# EAGLE design working (EAGLE 9.6.2)
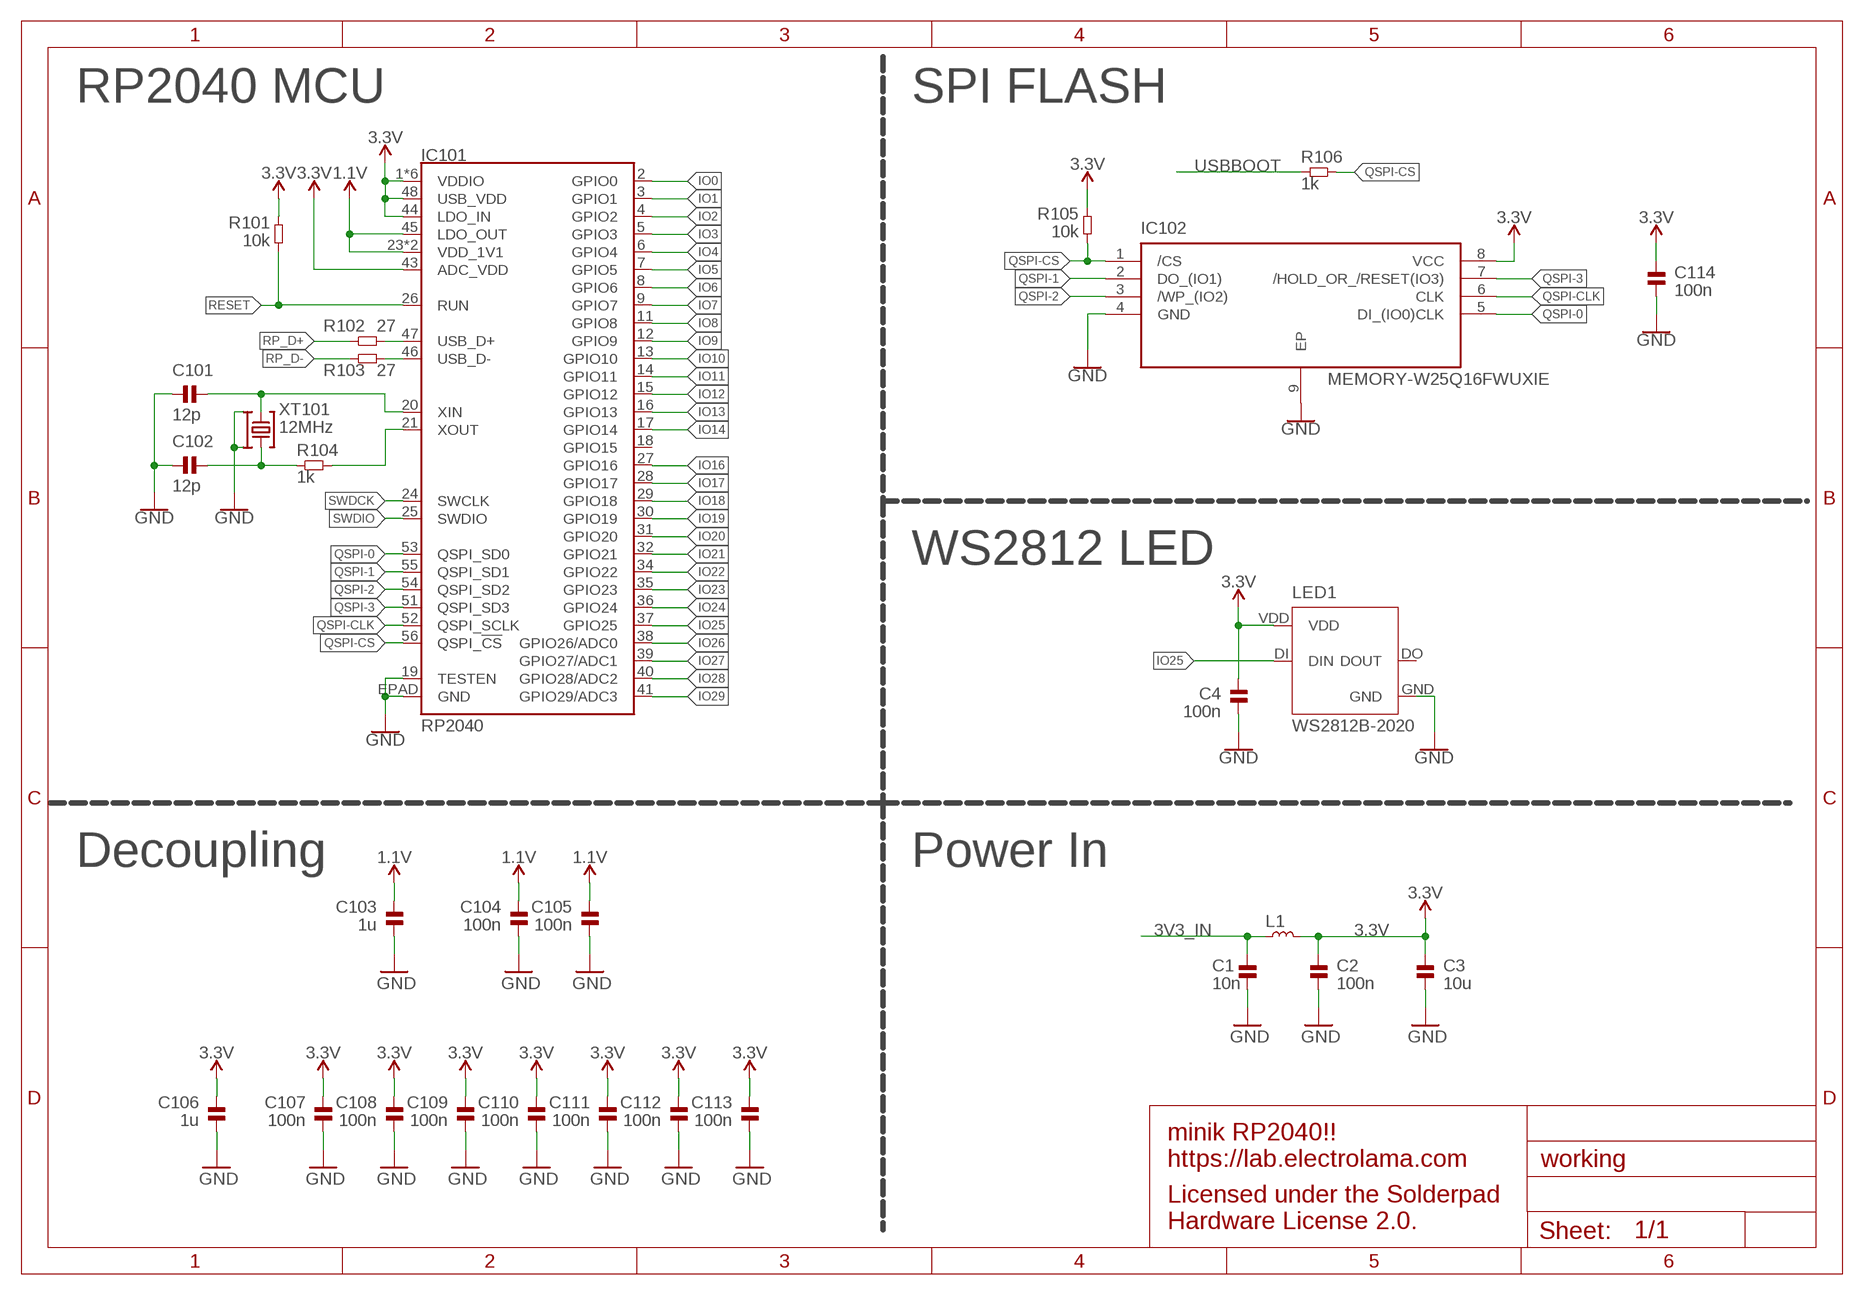
[diagram p0: schematic, sheet 1]

## Parts
C1  10n  CAP-0402  [_PKG_C_0402]
C2  100n  CAP-0402  [_PKG_C_0402]
C3  10u  CAP-0402  [_PKG_C_0402]
C4  100n  CAP-0402  [_PKG_C_0402]
C101  12p  CAP-0402  [_PKG_C_0402]
C102  12p  CAP-0402  [_PKG_C_0402]
C103  1u  CAP-0402  [_PKG_C_0402]
C104  100n  CAP-0402  [_PKG_C_0402]
C105  100n  CAP-0402  [_PKG_C_0402]
C106  1u  CAP-0402  [_PKG_C_0402]
C107  100n  CAP-0402  [_PKG_C_0402]
C108  100n  CAP-0402  [_PKG_C_0402]
C109  100n  CAP-0402  [_PKG_C_0402]
C110  100n  CAP-0402  [_PKG_C_0402]
C111  100n  CAP-0402  [_PKG_C_0402]
C112  100n  CAP-0402  [_PKG_C_0402]
C113  100n  CAP-0402  [_PKG_C_0402]
C114  100n  CAP-0402  [_PKG_C_0402]
IC101  RP2040  [QFN-56]
IC102  MEMORY-W25Q16FWUXIE  [SON50P300X200X60-9N]
L1  INDUCTOR-0402  [_PKG_L_0402]
LED1  WS2812B-2020  [WS2812B-2020]
R101  10k  RES-0402  [_PKG_R_0402]
R102  27  RES-0402  [_PKG_R_0402]
R103  27  RES-0402  [_PKG_R_0402]
R104  1k  RES-0402  [_PKG_R_0402]
R105  10k  RES-0402  [_PKG_R_0402]
R106  1k  RES-0402  [_PKG_R_0402]
XT101  12MHz  XTAL-4P-3225  [XTAL-4P-3225]

## Nets
1.1V: C103.2 C104.2 C105.2 IC101.23(VDD_1V1) IC101.45(LDO_OUT) IC101.50(VDD_1V1)
3.3V: C2.2 C3.2 C4.2 C106.2 C107.2 C108.2 C109.2 C110.2 C111.2 C112.2 C113.2 C114.2 IC101.1(VDDIO) IC101.10(VDDIO) IC101.22(VDDIO) IC101.33(VDDIO) IC101.42(VDDIO) IC101.43(ADC_VDD) IC101.44(LDO_IN) IC101.48(USB_VDD) IC101.49(VDDIO) IC102.8(VCC) L1.2 LED1.VDD R101.2 R105.2
3V3_IN: C1.2 L1.1
GND [Power]: C1.1 C2.1 C3.1 C4.1 C101.1 C102.1 C103.1 C104.1 C105.1 C106.1 C107.1 C108.1 C109.1 C110.1 C111.1 C112.1 C113.1 C114.1 IC101.19(TESTEN) IC101.EPAD(GND) IC102.4(GND) IC102.9(EP) LED1.GND XT101.2 XT101.4
IO0: IC101.2(GPIO0)
IO1: IC101.3(GPIO1)
IO2: IC101.4(GPIO2)
IO3: IC101.5(GPIO3)
IO4: IC101.6(GPIO4)
IO5: IC101.7(GPIO5)
IO6: IC101.8(GPIO6)
IO7: IC101.9(GPIO7)
IO8: IC101.11(GPIO8)
IO9: IC101.12(GPIO9)
IO10: IC101.13(GPIO10)
IO11: IC101.14(GPIO11)
IO12: IC101.15(GPIO12)
IO13: IC101.16(GPIO13)
IO14: IC101.17(GPIO14)
IO16: IC101.27(GPIO16)
IO17: IC101.28(GPIO17)
IO18: IC101.29(GPIO18)
IO19: IC101.30(GPIO19)
IO20: IC101.31(GPIO20)
IO21: IC101.32(GPIO21)
IO22: IC101.34(GPIO22)
IO23: IC101.35(GPIO23)
IO24: IC101.36(GPIO24)
IO25: IC101.37(GPIO25) LED1.DI(DIN)
IO26: IC101.38(GPIO26/ADC0)
IO27: IC101.39(GPIO27/ADC1)
IO28: IC101.40(GPIO28/ADC2)
IO29: IC101.41(GPIO29/ADC3)
N$3: IC101.47(USB_D+) R102.2
N$4: IC101.46(USB_D-) R103.2
QSPI-0: IC101.53(QSPI_SD0) IC102.5(DI_(IO0)CLK)
QSPI-1: IC101.55(QSPI_SD1) IC102.2(DO_(IO1))
QSPI-2: IC101.54(QSPI_SD2) IC102.3(/WP_(IO2))
QSPI-3: IC101.51(QSPI_SD3) IC102.7(/HOLD_OR_/RESET(IO3))
QSPI-CLK: IC101.52(QSPI_SCLK) IC102.6(CLK)
QSPI-CS: IC101.56(QSPI_!CS!) IC102.1(/CS) R105.1 R106.1
RESET: IC101.26(RUN) R101.1
RP_D+: R102.1
RP_D-: R103.1
SWDCK: IC101.24(SWCLK)
SWDIO: IC101.25(SWDIO)
USBBOOT: R106.2
X1A: IC101.21(XOUT) R104.2
X1B: C102.2 R104.1 XT101.1
X2: C101.2 IC101.20(XIN) XT101.3
Unconnected: IC101.18(GPIO15) LED1.DO(DOUT)

## Notes on the sheet
- RP2040 MCU | SPI FLASH
- WS2812 LED
- Decoupling | Power In
- minik RP2040!!
  https://lab.electrolama.com
- Licensed under the Solderpad
  Hardware License 2.0.

## Library data of the parts
C1-C4 C101-C114 = ok-discretes-dev:CAP
IC101 = RP2040:RP2040: Raspberry Pi RP2040 MCU 56-pin 32-bit Microcontroller with 264kB of SRAM and external flash support up to 16MB Getting Started with the RP2040 <https://pico.raspberrypi.org/getting-started/> Dual-core ARM Cortex M0+ processor, flexible clock running up to 133 MHz 264kB of SRAM, and QSPI control of common flash memory USB 1.1 Host and Device support Low-power sleep and dormant modes Drag & drop programming using mass storage over USB 26 multi-function GPIO pins 2×SPI, 2×I2C, 2×UART, 3×12-bit ADC, 16×controllable PWM channels Accurate clock and timer on-chip Temperature sensor Accelerated floating point libraries on-chip 8×Programmable IO (PIO) state machines for custom peripheral support; PROD_ID: IC-15502
IC102 = ok-chips-dev:MEMORY-W25Q16FWUXIE: FLASH - NOR Memory IC 16Mb (2M x 8) SPI 104MHz 8-USON (2x3) Source: Datasheet <https://www.winbond.com/resource-files/w25q16fw reve 10072015 sfdp.pdf>; ARROW_PART_NUMBER: W25Q16FWUXIE TR; ARROW_PRICE-STOCK: https://www.arrow.com/en/products/w25q16fwuxietr/winbond-electronics; DESCRIPTION: FLASH - NOR Memory IC 16Mb (2M x 8) SPI 104MHz 8-USON (2x3); HEIGHT: 0.6mm; MANUFACTURER_NAME: Winbond; MANUFACTURER_PART_NUMBER: W25Q16FWUXIE TR; MOUSER_PART_NUMBER: 454-W25Q16FWUXIETR; MOUSER_PRICE-STOCK: https://www.mouser.co.uk/ProductDetail/Winbond/W25Q16FWUXIE-TR?qs=qSfuJ%252Bfl%2Fd73qYu7obAG3g%3D%3D
L1 = ok-discretes-dev:INDUCTOR
LED1 = ok-opto-dev:WS2812B-2020
R101-R106 = ok-discretes-dev:RES
XT101 = ok-xtal-osc-dev:XTAL-4P-3225

## Net classes
1 Power: width 0.127 mm, clearance 0.178 mm

## Board
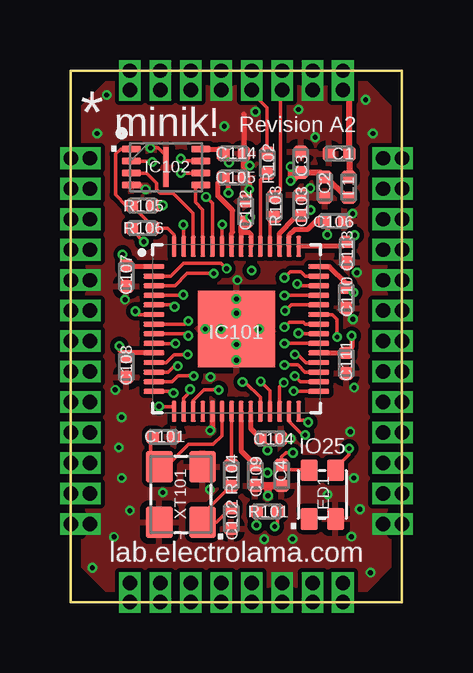
[diagram p1: board, top side]
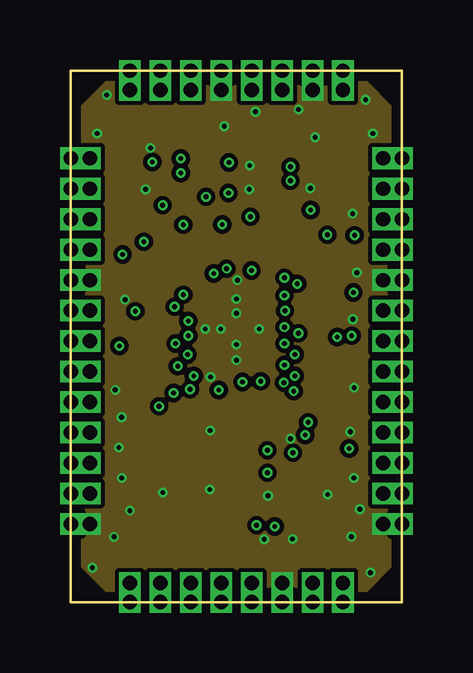
[diagram p2: board, inner layer Route2]
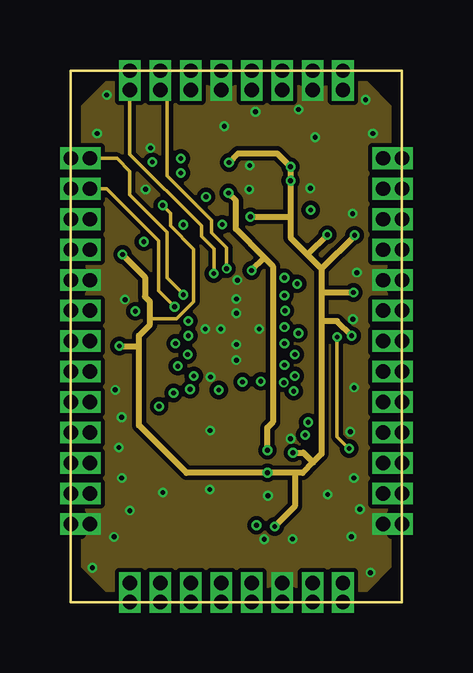
[diagram p3: board, inner layer Route15]
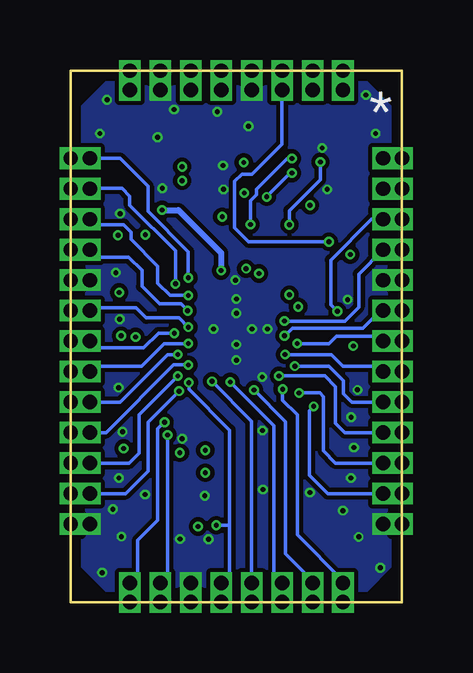
[diagram p4: board, bottom side, seen from below]

Size 13.82 x 22.14 mm. Coordinates in mm from the lower left corner, seen from the top.
Outline: 0,0 0,22.14 13.82,22.14 13.82,0 0,0
Copper layers (1*2*15*16): Top 0.035559375mm / dielectric 0.17018125mm / Route2 0.01778125mm / dielectric 47mil / Route15 0.01778125mm / dielectric 0.17018125mm / Bottom 0.035559375mm
Design rules "oshpark-4layer *": minimum track width 5mil, minimum drill 10mil, track to track 5mil, track to pad 5mil, pad to pad 5mil, via to via 5mil, smd to smd 5mil, copper to edge 15mil, drill to drill 6mil, minimum pad ring 4mil, minimum via ring 4mil, stop-mask expansion 2.5mil, vias tented up to drill 20mil, thermal gap 10mil

### Footprints (pad centres in the part's own frame; a part is rotated, then mirrored left to right if it is on the bottom)
_PKG_C_0402 = smd 0.54 x 0.6: 1 -0.43,0; 2 0.43,0
QFN-56 = smd 0.875 x 0.2: 1 -3.437,2.6; 2 -3.437,2.2; 3 -3.437,1.8; 4 -3.437,1.4; 5 -3.437,1; 6 -3.437,0.6; 7 -3.437,0.2; 8 -3.437,-0.2; 9 -3.437,-0.6; 10 -3.437,-1; 11 -3.437,-1.4; 12 -3.437,-1.8; 13 -3.437,-2.2; 14 -3.437,-2.6; 29 3.437,-2.6; 30 3.437,-2.2; 31 3.437,-1.8; 32 3.437,-1.4; 33 3.437,-1; 34 3.437,-0.6; 35 3.437,-0.2; 36 3.437,0.2; 37 3.437,0.6; 38 3.437,1; 39 3.437,1.4; 40 3.437,1.8; 41 3.437,2.2; 42 3.437,2.6 | smd 0.2 x 0.875: 15 -2.6,-3.437; 16 -2.2,-3.437; 17 -1.8,-3.437; 18 -1.4,-3.437; 19 -1,-3.437; 20 -0.6,-3.437; 21 -0.2,-3.437; 22 0.2,-3.437; 23 0.6,-3.437; 24 1,-3.437; 25 1.4,-3.437; 26 1.8,-3.437; 27 2.2,-3.437; 28 2.6,-3.437; 43 2.6,3.437; 44 2.2,3.437; 45 1.8,3.437; 46 1.4,3.437; 47 1,3.437; 48 0.6,3.437; 49 0.2,3.437; 50 -0.2,3.437; 51 -0.6,3.437; 52 -1,3.437; 53 -1.4,3.437; 54 -1.8,3.437; 55 -2.2,3.437; 56 -2.6,3.437 | smd 3.2 x 3.2: EPAD 0,0
SON50P300X200X60-9N = smd 0.8 x 0.3: 1 -1.45,0.75; 2 -1.45,0.25; 3 -1.45,-0.25; 4 -1.45,-0.75; 5 1.45,-0.75; 6 1.45,-0.25; 7 1.45,0.25; 8 1.45,0.75 | smd 0.25 x 1.65: 9 0,0
_PKG_L_0402 = smd 0.54 x 0.6: 1 -0.43,0; 2 0.43,0
WS2812B-2020 = smd 0.9 x 0.7: DI -1.015,0.55; DO 1.015,-0.55; GND 1.015,0.55; VDD -1.015,-0.55
_PKG_R_0402 = smd 0.54 x 0.6: 1 -0.43,0; 2 0.43,0
XTAL-4P-3225 = smd 1.3 x 1.1: 1 -1.15,-0.9; 2 1.15,-0.9; 3 1.15,0.9; 4 -1.15,0.9

### Placement (x,y rotation side)
C1  11.19,18.68 0 top
C2  10.59,17.28 90 top
C3  9.59,18.33 270 top
C4  8.79,5.28 90 top
C101  3.85,6.88 180 top
C102  6.69,3.48 90 top
C103  9.59,16.53 270 top
C104  8.34,6.82 180 top
C105  6.79,17.68 180 top
C106  10.99,15.88 180 top
C107  2.32,13.58 90 top
C108  2.32,9.8 90 top
C109  7.69,5.28 90 top
C110  11.49,12.68 90 top
C111  11.49,9.96 90 top
C112  7.3,16.28 270 top
C113  11.52,14.58 90 top
C114  6.79,18.68 180 top
IC101  6.91,11.38 0 top
IC102  3.98,18.13 0 top
L1  11.59,17.28 270 top
LED1  10.49,4.48 270 top
R101  8.19,3.78 0 top
R102  8.19,18.28 270 top
R103  8.49,16.48 270 top
R104  6.69,5.28 90 top
R105  2.99,16.52 0 top
R106  2.99,15.58 180 top
XT101  4.59,4.48 90 top

### Tracks (layer width: path | path; a pad name or v marks a point on that pad's centre or on a via)
1.1V  (via drill 0.2)
  Top 0.152: 6.71,15.37 6.76,15.42 | C105.2 | v8.2,6.32 8.2,6.52 C104.2
  Top 0.203: IC101.45 8.71,15.37 9.3,15.96 9.46,15.96 C103.2 9.82,16.33 v10.01,16.33 | 6.76,15.42 6.76,16.32 6.14,16.93 6.14,17.46 C105.2 | IC101.50 6.71,15.37 | v6.58,17.04 6.55,17.07 6.55,17.5 C105.2 | C104.2 7.51,7.23 IC101.23
  Route15 0.254: v8.2,6.32 8.2,7.26 8.43,7.49 8.43,14 8.08,14.35 | 8.08,14.35 6.88,15.55 6.88,16.74 v6.58,17.04 | v7.54,13.82 8.08,14.35
  Bottom 0.254: v10.01,16.33 9.32,16.33 7.54,14.55 v7.54,13.82
3.3V  (via drill 0.2)
  Top 0.152: IC101.49 | R105.2 3.82,16.52 v3.84,16.54 | R101.2 8.62,3.26 v8.51,3.15 | 7.11,15.67 C112.2 | 9.55,17.9 C3.2 | C109.2 7.79,5.71 8.12,5.39 v8.2,5.39 | LED1.VDD 9.93,5.51 8.99,5.51 C4.2 8.79,6.05 8.97,6.22 v9.27,6.22
  Top 0.203: IC101.22 7.11,6.31 C109.2 | IC101.44 9.11,15.3 9.34,15.53 9.89,15.53 10.24,15.88 C106.2 10.72,15.73 10.72,15.32 v10.7,15.31 | 7.11,15.39 IC101.49 | 7.11,15.39 7.44,15.39 7.51,15.33 IC101.48 | IC102.8 6.17,18.88 C114.2 6.36,18.55 v6.6,18.31 | IC101.42 10.79,13.98 11.49,13.28 C110.2 11.58,13.11 | 7.11,15.39 7.11,15.67 | IC101.1 2.35,13.98 C107.2 2.16,14.17 v2.16,14.48 | IC101.10 2.47,10.38 C108.2 2.03,10.52 v2.03,10.67 | IC101.33 C111.2 11.72,10.61 v11.72,11.1 | IC101.43 9.53,14.84 11.34,14.84 C113.2 11.57,15.01 v11.84,15.28
  Top 0.254: L1.2 11.53,16.85 10.67,17.71 C2.2 10.4,17.9 C3.2 9.24,17.55 v9.17,17.55 v9.17,18.14 9.4,17.9 9.55,17.9 | C112.2 v7.49,16.05 | 11.58,13.11 v11.79,12.9
  Route15 0.152: v3.84,16.54 4.17,16.21 4.17,15.67 5.13,14.71 5.13,12.52 4.42,11.81 3.3,11.81
  Route15 0.254: 9.17,16.05 v9.17,18.14 8.61,18.69 6.99,18.69 v6.6,18.31 | 9.17,16.05 9.17,15.19 9.88,14.48 | 9.88,14.48 10.47,13.89 | 10.47,13.89 10.47,12.93 | 10.47,12.93 10.47,11.71 | 10.47,11.71 10.47,6.17 10.11,5.82 | 9.35,5.39 9.68,5.39 10.11,5.82 | 9.35,5.39 v8.2,5.39 4.83,5.39 2.84,7.37 2.84,10.67 | 2.84,10.67 2.84,11.1 3.3,11.56 3.3,11.81 3.3,12.52 3.1,12.73 3.1,13.54 v2.16,14.48 | v9.27,6.22 9.7,6.22 10.11,5.82 | v11.72,11.1 11.1,11.71 10.47,11.71 | v11.79,12.9 10.5,12.9 10.47,12.93 | v11.84,15.28 11.84,15.27 10.47,13.89 | v10.7,15.31 9.88,14.49 9.88,14.48 | v2.03,10.67 2.84,10.67 | 9.35,5.39 9.35,3.99 v8.51,3.15 | v7.49,16.05 9.17,16.05
3V3_IN  (via drill 0.6)
  Top 0.254: v11.35,21.34 11.62,21.07 C1.2 11.62,17.74 L1.1
3V3_IN1  (via drill 0.6)
  other vias: 11.35,22.14
GND  (via drill 0.2, 0.6)
  Top 0.152: IC102.4 2.94,17.38 v3.12,17.2 | v3.33,18.92 3.65,18.92 3.99,18.58 3.99,18.14 IC102.9
  Top 0.2: 7.22,20.34 C114.1
  Top 0.203: IC101.19 5.91,7.24 v5.82,7.15 | C103.1 9.87,17.24 v9.99,17.24 | v9.17,6.8 8.79,6.8 C104.1
  Top 0.254: 7.24,18.19 7.22,18.2 C114.1 | C112.1 7.44,16.86 v7.44,17.2 7.44,17.4 7.22,17.62 C105.1 | C113.1 11.52,14.14 | v11.76,16.19 11.45,15.88 C106.1
  Top 0.305: v7.47,18.19 7.24,18.19 | v8.23,4.43 8.23,4.85 | 8.23,4.85 C4.1 | C109.1 8.23,4.85
  other vias: 10.08,21.34 6.27,21.34 13.02,13.41 13.02,3.25 0.79,3.25 0.79,13.41 10.2,19.37 11.77,11.78 11.82,8.94 6.91,12.63 7.86,11.38 5.61,11.38 6.91,10.08 11.66,7.1 11.81,5.17 10.72,4.48 12.06,3.87 3.84,4.56 1.8,2.72 1.86,8.84 2.26,12.6 11.94,13.73 2.12,7.7 2.01,6.44 2.47,3.81 5.83,9.37 6.95,13.41 6.91,12.03 6.26,11.38 6.91,10.73 8.81,0.79 0.9,1.43 5.8,4.69 2.13,5.17 11.7,2.73 12.5,1.23 9.25,2.63 1.1,19.53 1.5,21.13 6.4,19.83 9.5,20.53 7.7,20.43 12.3,20.93 12.6,19.53 8.07,2.62
  pour Route2: 0.23,1.74 0.23,20.39 1.74,21.91 12.08,21.91 13.59,20.39 13.59,1.74 12.08,0.23 1.74,0.23
  pour Top: 0.23,1.74 0.23,20.39 1.74,21.91 12.08,21.91 13.59,20.39 13.59,1.74 12.08,0.23 1.74,0.23
  pour Route15: 0.23,1.74 0.23,20.39 1.74,21.91 12.08,21.91 13.59,20.39 13.59,1.74 12.08,0.23 1.74,0.23
  pour Bottom: 0.23,1.74 0.23,20.39 1.74,21.91 12.08,21.91 13.59,20.39 13.59,1.74 12.08,0.23 1.74,0.23
GND1  (via drill 0.6)  (1 unrouted)
  other vias: 10.08,22.14 6.27,22.14
GND2  (via drill 0.6)  (1 unrouted)
  other vias: 13.82,13.41 13.82,3.25
GND3  (via drill 0.6)  (1 unrouted)
  other vias: 0,3.25 0,13.41
GND4  (via drill 0.6)
  other vias: 8.81,0
IO0  (via drill 0.2, 0.6)
  Top 0.152: IC101.2 4.16,13.58 4.7,14.12 6.27,14.12 v6.5,13.89
  Route15 0.152: v3.73,21.34 4.01,21.06 4.01,17.75 5.87,15.9 5.87,15.39 6.5,14.76 v6.5,13.89
IO1  (via drill 0.2, 0.6)
  Top 0.152: IC101.3 4.34,13.18 4.85,13.69 v5.97,13.69
  Route15 0.152: v2.46,21.34 2.46,18.67 5.46,15.67 5.46,15.24 5.97,14.73 v5.97,13.69
IO2  (via drill 0.2, 0.6)
  Top 0.152: IC101.4 4.68,12.78 v4.7,12.8
  Route15 0.152: v4.7,12.8 4.7,12.83 4.01,13.51 4.01,15.42 2.46,16.97 2.46,17.96 1.93,18.49 v0.79,18.49
IO3  (via drill 0.2, 0.6)
  Top 0.152: v4.33,12.31 4.26,12.38 IC101.5
  Route15 0.152: v4.33,12.31 3.66,12.98 3.66,15.06 1.5,17.22 v0.79,17.22
IO4  (via drill 0.2, 0.6)
  Top 0.152: IC101.6 2.83,11.98 v2.69,12.12
  Bottom 0.152: v0.79,15.95 1.27,15.95 2.97,14.25 2.97,12.4 v2.69,12.12
IO5  (via drill 0.2, 0.6)
  Top 0.152: IC101.7 4.77,11.58 v4.9,11.71
  Bottom 0.152: v0.79,14.68 1.81,13.67 1.81,12.29 2.39,11.71 v4.9,11.71
IO6  (via drill 0.2, 0.6)
  Top 0.152: IC101.8 4.82,11.18 v4.9,11.1
  Bottom 0.152: v0.79,12.14 0.9,12.14 1.63,11.4 4.57,11.4 4.88,11.1 v4.9,11.1
IO7  (via drill 0.2, 0.6)
  Top 0.152: v4.37,10.77 3.48,10.77 IC101.9
  Bottom 0.152: v0.79,10.87 1,11.07 2.74,11.07 3.05,10.77 v4.37,10.77
IO8  (via drill 0.2, 0.6)
  Top 0.152: IC101.11 3.99,9.98 4.32,10.31 v4.88,10.31
  Bottom 0.152: v0.79,9.6 1.02,9.83 2.46,9.83 2.95,10.31 v4.88,10.31
IO9  (via drill 0.2, 0.6)
  Top 0.152: IC101.12 4.07,9.58 4.32,9.83 v4.47,9.83
  Bottom 0.152: v0.79,8.33 2.08,8.33 2.44,8.69 2.44,9.22 3.05,9.83 v4.47,9.83
IO10  (via drill 0.2, 0.6)
  Top 0.152: IC101.13 4.23,9.18 4.47,9.42 v5.13,9.42
  Bottom 0.152: v0.79,7.06 2.39,7.06 2.77,7.44 2.77,8.97 3.23,9.42 v5.13,9.42
IO11  (via drill 0.2, 0.6)
  Top 0.152: IC101.14 4.22,8.78 v4.29,8.71
  Bottom 0.152: v0.79,5.79 2.77,5.79 3.28,6.3 3.28,8.56 3.43,8.71 v4.29,8.71
IO12  (via drill 0.2, 0.6)
  Top 0.152: IC101.15 4.31,8.12 4.28,8.15 v3.69,8.15 v3.68,8.15
  Bottom 0.152: v0.79,4.52 3.1,4.52 3.86,5.28 3.86,7.98 v3.68,8.15
IO13  (via drill 0.2, 0.6)
  Top 0.152: IC101.16 4.71,8.49 4.98,8.76 v4.98,8.86
  Bottom 0.152: v2.46,0.79 2.46,0.9 4.37,2.8 4.37,7.8 4.98,8.41 v4.98,8.86
IO14  (via drill 0.2, 0.6)
  Top 0.152: IC101.17 5.11,8.39 5.56,8.84 v6.17,8.84
  Bottom 0.152: v3.73,0.79 3.73,0.9 4.85,2.01 4.85,7.52 v6.17,8.84
IO15  (via drill 0.6)
  other vias: 2.46,22.14
IO16  (via drill 0.2, 0.6)
  Top 0.152: IC101.27 9.11,7.53 9.68,6.96 v9.78,6.96
  Bottom 0.152: v10.08,0.79 9.78,1.1 v9.78,6.96
IO17  (via drill 0.2, 0.6)
  Top 0.152: IC101.28 9.51,7.57 9.83,7.57 v9.91,7.49
  Bottom 0.152: v9.91,7.49 10.19,7.21 10.19,3.4 11.02,2.57 11.02,1.12 v11.35,0.79
IO18  (via drill 0.2, 0.6)
  Top 0.152: IC101.29 v9.3,8.78 v9.3,8.79
  Bottom 0.152: v13.02,4.52 11.53,4.52 10.59,5.46 10.59,7.49 v9.3,8.79
IO19  (via drill 0.2, 0.6)
  Top 0.152: IC101.30 9.59,9.18 v9.35,9.42
  Bottom 0.152: v13.02,5.79 11.38,5.79 10.97,6.2 10.97,7.8 v9.35,9.42
IO20  (via drill 0.2, 0.6)
  Top 0.152: IC101.31 9.77,9.58 9.47,9.88 v8.92,9.88
  Bottom 0.152: v13.02,7.06 12.34,7.06 9.53,9.88 v8.92,9.88
IO21  (via drill 0.2, 0.6)
  Top 0.152: IC101.32 9.81,9.98 9.47,10.31 v9.35,10.31
  Bottom 0.152: v13.02,8.33 11.76,8.33 9.78,10.31 v9.35,10.31
IO22  (via drill 0.2, 0.6)
  Top 0.152: IC101.34 8.93,10.78 v8.92,10.77
  Bottom 0.152: v8.92,10.77 9.93,10.77 10.87,9.83 12.8,9.83 v13.02,9.6
IO23  (via drill 0.2, 0.6)
  Top 0.152: IC101.35 9.52,11.18 v9.5,11.2
  Bottom 0.152: v9.5,11.2 10.16,11.2 10.77,10.59 12.74,10.59 v13.02,10.87
IO24  (via drill 0.2, 0.6)
  Top 0.152: IC101.36 9.78,11.58 9.7,11.66 9.12,11.66 v8.92,11.46
  Bottom 0.152: v8.92,11.46 9.3,11.84 10.67,11.84 11.1,12.27 12.9,12.27 v13.02,12.14
IO25  (via drill 0.2)
  Top 0.152: IC101.37 10.92,11.98 11.11,11.79 v11.11,11.05 | v11.61,6.4 11.61,6.15 11.04,5.58 LED1.DI
  Route15 0.152: v11.61,6.4 11.11,6.9 v11.11,11.05
IO26  (via drill 0.2, 0.6)
  Top 0.152: IC101.38 9.21,12.38 8.97,12.14 v8.94,12.14
  Bottom 0.152: v8.94,12.14 9.22,12.42 10.11,12.42 10.85,13.16 10.85,13.82 11.4,14.38 12.72,14.38 v13.02,14.68
IO27  (via drill 0.2, 0.6)
  Top 0.152: IC101.39 v8.92,12.78
  Bottom 0.152: v13.02,15.95 12.8,15.73 11.61,15.73 11.3,15.42 11.3,15.11 10.19,14 10.19,13.28 9.68,12.78 v8.92,12.78
IO28  (via drill 0.2, 0.6)
  Top 0.152: IC101.40 9.53,13.18 v9.45,13.26
  Bottom 0.152: v13.02,17.22 13,17.25 11.68,17.25 11.35,16.92 11.35,16.54 9.45,14.63 v9.45,13.26
IO29  (via drill 0.2, 0.6)
  Top 0.152: IC101.41 9.79,13.58 9.6,13.77 9.17,13.77 v8.92,13.51
  Bottom 0.152: v13.02,18.49 11.76,18.49 10.59,17.32 10.59,16.28 8.92,14.61 v8.92,13.51
IO30  (via drill 0.6)
  other vias: 3.73,22.14
IO31  (via drill 0.6)
  other vias: 13.82,4.52
IO32  (via drill 0.6)
  other vias: 13.82,5.79
IO33  (via drill 0.6)
  other vias: 13.82,7.06
IO34  (via drill 0.6)
  other vias: 13.82,8.33
IO35  (via drill 0.6)
  other vias: 13.82,9.6
IO36  (via drill 0.6)
  other vias: 13.82,10.87
IO37  (via drill 0.6)
  other vias: 13.82,12.14
IO38  (via drill 0.6)
  other vias: 13.82,14.68
IO39  (via drill 0.6)
  other vias: 13.82,15.95
IO40  (via drill 0.6)
  other vias: 13.82,17.22
IO41  (via drill 0.6)
  other vias: 13.82,18.49
IO42  (via drill 0.6)
  other vias: 0,18.49
IO43  (via drill 0.6)
  other vias: 0,17.22
IO44  (via drill 0.6)
  other vias: 0,15.95
IO45  (via drill 0.6)
  other vias: 0,14.68
IO46  (via drill 0.6)
  other vias: 0,12.14
IO47  (via drill 0.6)
  other vias: 0,10.87
IO48  (via drill 0.6)
  other vias: 0,9.6
IO49  (via drill 0.6)
  other vias: 0,8.33
IO50  (via drill 0.6)
  other vias: 0,7.06
IO51  (via drill 0.6)
  other vias: 0,5.79
IO52  (via drill 0.6)
  other vias: 0,4.52
IO53  (via drill 0.6)
  other vias: 2.46,0
IO54  (via drill 0.6)
  other vias: 3.73,0
IO55  (via drill 0.6)
  other vias: 10.08,0
IO56  (via drill 0.6)
  other vias: 11.35,0
N$3
  Top 0.152: IC101.47 7.91,17.6 8.16,17.85 R102.2
N$4
  Top 0.152: IC101.46 8.31,15.87 R103.2
QSPI-0
  Top 0.152: IC101.53 5.5,16.35 5.2,16.65 5.2,17.38 IC102.5
QSPI-1  (via drill 0.2)
  Top 0.152: v4.7,15.72 4.71,15.71 IC101.55 | IC102.2 3.37,18.38 v3.4,18.34
  Bottom 0.152: v4.7,15.72 4.7,16.31 3.4,17.6 v3.4,18.34
QSPI-2
  Top 0.152: IC101.54 5.11,16.21 4.27,17.04 3.73,17.04 3.58,17.2 3.58,17.45 3.15,17.88 IC102.3
QSPI-3  (via drill 0.2)
  Top 0.152: IC101.51 v6.31,15.72 v6.32,15.73 | IC102.7 4.69,18.38 v4.59,18.48
  Bottom 0.152: v6.32,15.73 6.32,16.72 6.07,16.98 6.07,17.21 4.79,18.48 v4.59,18.48
QSPI-CLK  (via drill 0.2)
  Top 0.152: v5.64,16.88 5.91,16.62 IC101.52 | IC102.6 v4.6,17.88 v4.59,17.88
  Bottom 0.152: v5.64,16.88 4.64,17.88 v4.59,17.88
QSPI-CS
  Top 0.152: IC102.1 2.07,18.88 1.87,18.67 1.87,16.97 2.31,16.52 R105.1 3.42,15.66 R106.1 4.03,15.58 4.31,15.31 IC101.56
RESET  (via drill 0.2, 0.6)
  Top 0.152: v8.89,9.14 8.71,8.97 IC101.26 | R101.1 7.75,3.76 v7.75,3.2
  Bottom 0.152: 7.19,3.2 7.19,7.16 8.89,8.86 v8.89,9.14 | 7.19,3.2 7.19,1.15 v7.54,0.79 | v7.75,3.2 7.19,3.2
RESET1  (via drill 0.6)
  other vias: 7.54,0
RP_D+  (via drill 0.6)
  Top 0.152: R102.1 8.19,20.59 7.54,21.24 v7.54,21.34
RP_D+1  (via drill 0.6)
  other vias: 7.54,22.14
RP_D-  (via drill 0.6)
  Top 0.152: R103.1 8.74,17.16 8.74,21.27 v8.81,21.34
RP_D-1  (via drill 0.6)
  other vias: 8.81,22.14
SWDCK  (via drill 0.2, 0.6)
  Top 0.152: IC101.24 7.91,8.53 7.26,9.17 v7.16,9.17
  Bottom 0.152: v5,0.79 5.33,1.12 5.33,7.34 v7.16,9.17
SWDCK1  (via drill 0.6)
  other vias: 5,0
SWDIO  (via drill 0.2, 0.6)
  Top 0.152: v7.92,9.2 8.31,8.81 IC101.25
  Bottom 0.152: v6.27,0.79 6.27,7.54 v7.92,9.2
SWDIO1  (via drill 0.6)
  other vias: 6.27,0
USBBOOT  (via drill 0.2, 0.6)
  Top 0.152: v3.05,15.01 v3.05,15.02 2.56,15.51 R106.2
  Bottom 0.152: v3.05,15.01 6.4,15.01 6.99,15.6 6.99,17.53 6.68,17.83 6.25,17.83 5,19.08 v5,21.34
USBBOOT1  (via drill 0.6)
  other vias: 5,22.14
X1A
  Top 0.152: IC101.21 6.71,5.65 R104.2
X1B
  Top 0.152: C102.2 6.66,3.91 6.08,3.33 XT101.1 5.49,3.65 R104.1
X2
  Top 0.152: IC101.20 6.31,6.93 5.94,6.57 4.91,6.57 3.97,5.63 XT101.3 3.32,6 3.32,6.78 C101.2

### Text on the board
tPlace: * | minik! | Revision A2 | . | IO25 | . | . | lab.electrolama.com
bPlace: *
legend: GPIO1 | GPIO0 | USBBOOT | GND | USB_DP | USB_DM | GND | 3V3_IN | GPIO2 | GPIO29/ADC3 | GPIO3 | GPIO28/ADC2 | GPIO4 | GPIO27/ADC1 | GPIO5 | GPIO26/ADC0 | GND | GND | GPIO6 | GPIO24 | GPIO7 | GPIO23 | GPIO8 | GPIO22 | GPIO9 | GPIO21 | GPIO10 | GPIO20 | GPIO11 | GPIO19 | GPIO12 | GPIO18 | GND | GND | GPIO13 | GPIO14 | SWDCLK | SWDIO | RUN/RESET | GND | GPIO16 | GPIO17